# EAGLE design companion_revc (EAGLE 7.2.0)
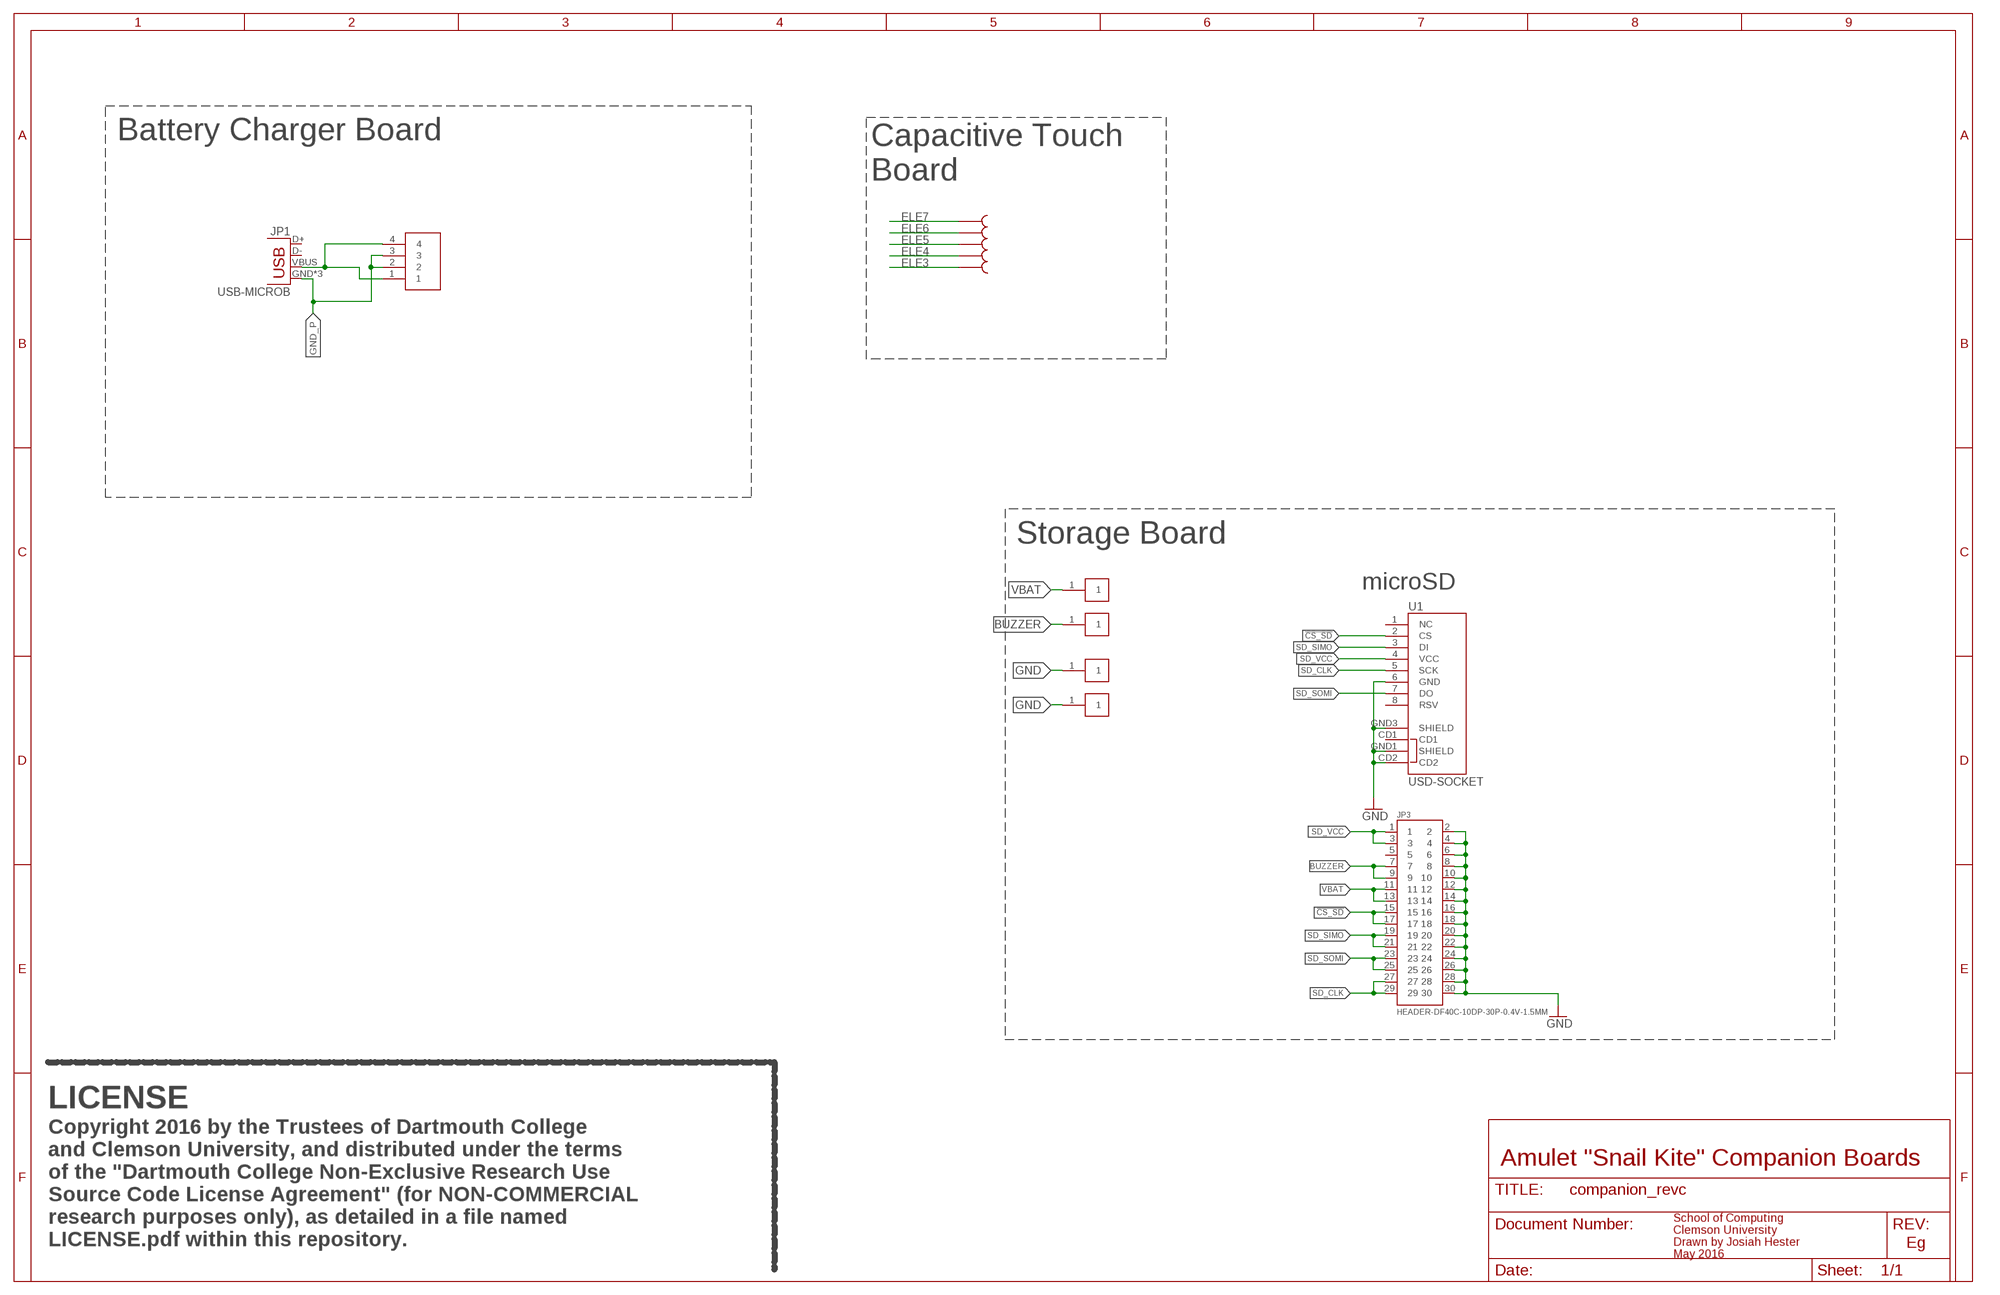
[diagram p0: schematic, sheet 1]

## Parts
JP1  USB-MICROB  [USB-MICROB]
JP3  HEADER-DF40C-10DP-30P-0.4V-1.5MM  [HEADER-DF40-30]
U1  USD-SOCKET  [MICROSD_1:1]
U$1  CTPAD  [CTPAD]
U$2  CTPAD  [CTPAD]
U$3  CTPAD  [CTPAD]
U$4  CTPAD  [CTPAD]
U$5  CTPAD  [CTPAD]
U$6  1PAD  [5X23MM_PAD]
U$7  1PAD  [5X23MM_PAD]
U$8  1PAD  [5X23MM_PAD]
U$9  1PAD  [5X23MM_PAD]
U$10  1.27MM-MILLMAX  [1X03-1.27MM]

## Nets
!CS_SD: JP3.15 JP3.17 U1.2(CS)
BUZZER: JP3.7 JP3.9 U$7.1
ELE3: U$5.P$1
ELE4: U$4.P$1
ELE5: U$3.P$1
ELE6: U$2.P$1
ELE7: U$1.P$1
GND: JP3.2 JP3.4 JP3.6 JP3.8 JP3.10 JP3.12 JP3.14 JP3.16 JP3.18 JP3.20 JP3.22 JP3.24 JP3.26 JP3.28 JP3.30 U1.6(GND) U1.CD2 U1.GND1(SHIELD) U1.GND3(SHIELD) U$8.1 U$9.1
GND_P: JP1.GND JP1.MT1(GND) JP1.MT2(GND) U$10.2 U$10.3
SD_CLK: JP3.27 JP3.29 U1.5(SCK)
SD_SIMO: JP3.19 JP3.21 U1.3(DI)
SD_SOMI: JP3.23 JP3.25 U1.7(DO)
SD_VCC: JP3.1 JP3.3 U1.4(VCC)
USB_VIN: JP1.VBUS U$10.1 U$10.4
VBAT: JP3.11 JP3.13 U$6.1
Unconnected: JP1.D+ JP1.D- JP3.5 U1.1(NC) U1.8(RSV) U1.CD1

## Notes on the sheet
- Battery Charger Board
- Capacitive Touch
  Board
- Storage Board
- microSD
- LICENSE
- Amulet "Snail Kite" Companion Boards
- Copyright 2016 by the Trustees of Dartmouth College 
  and Clemson University, and distributed under the terms
  of the "Dartmouth College Non-Exclusive Research Use 
  Source Code License Agreement" (for NON-COMMERCIAL
  research purposes only), as detailed in a file named 
  LICENSE.pdf within this repository.
- Eg
- School of Computing
  Clemson University
  Drawn by Josiah Hester
  May 2016

## Library data of the parts
JP1 = SparkFun-Connectors:USB: USB Connectors USB-B-PTH is fully proven SKU : PRT-00139/CONN-08278 USB-miniB is fully proven SKU : PRT-00587 USB-A-PCB is untested. USB-A-H is throughly reviewed, but untested. Spark Fun Electronics SKU : PRT-00437 USB-B-SMT is throughly reviewed, but untested. Needs silkscreen touching up. USB-A-S has not been used/tested USB-MB-H has not been used/tested USB-MICROB has been used. CONN-09505; PROD_ID: CONN-09505
JP3 = connectors:HEADER-DF40C-10DP-30P-0.4V-1.5MM: DF40 Series●0.4mm Pitch, 1.5 to 4.0mm Height, Board-to-Board and Board-to-FPC Connector 1.5mm Header (For use with shielded product) Digi-Key Part Number H11622CT-ND Quantity Available 3,874 Can ship immediately Manufacturer Hirose Electric Co Ltd </en/supplier-centers/h/hirose> Manufacturer Part Number DF40C-30DP-0.4V(51) Description 30 Position Connector Plug, Outer Shroud Contacts Surface Mount Gold Lead Free Status / RoHS Status Lead free / RoHS Compliant Moisture Sensitivity Level (MSL) 1 (Unlimited) Manufacturer Standard Lead Time 8 Weeks; DIGIKEY: H11622CT-ND
U1 = SparkFun-Connectors:USD-SOCKET: microSD Socket Push-push type uSD socket. Schematic element and footprint production proven. Spark Fun Electronics SKU : PRT-00127. tDoc lines correctly indicate media card edge positions when inserting (unlocked, locked, depressed). NOTE: CD1 and CD2 are connected internally; PROD_ID: CONN-07820
U$1-U$5 = captouch:CTPAD
U$6-U$9 = smd-pads:1PAD
U$10 = 1.27mm-headers:1.27MM-MILLMAX: Manafacturer: Mill-Max Manufacturing Corp. Manafacturer Part #: 851-13-004-40-001000 Description: 4 Position Receptacle Connector 0.050" (1.27mm) Surface Mount, Right Angle Gold

## Board
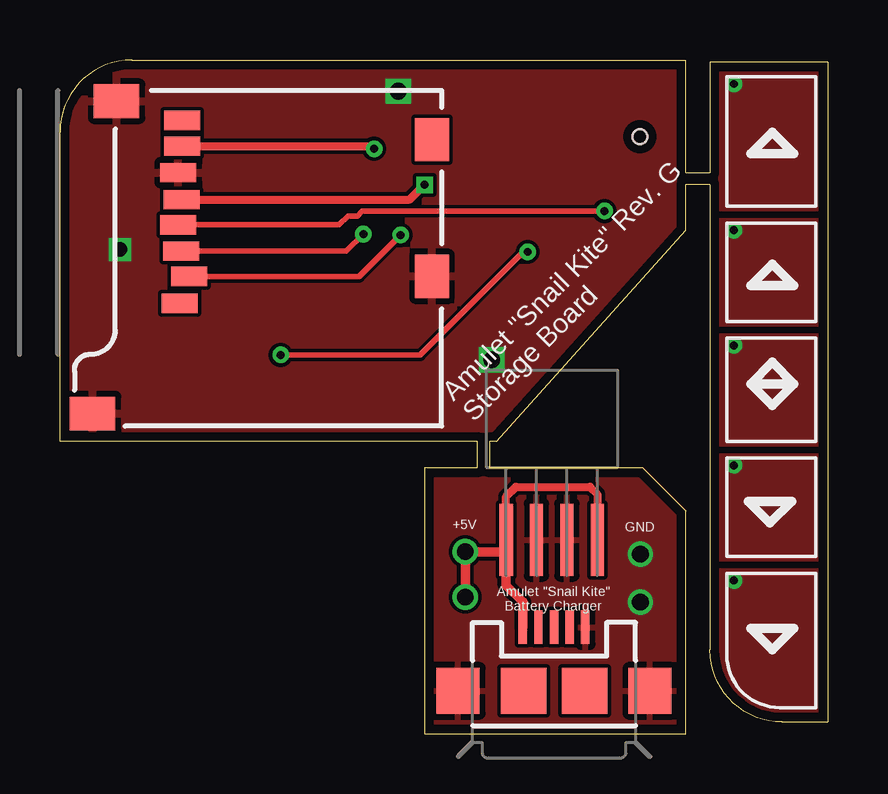
[diagram p1: board, top side]
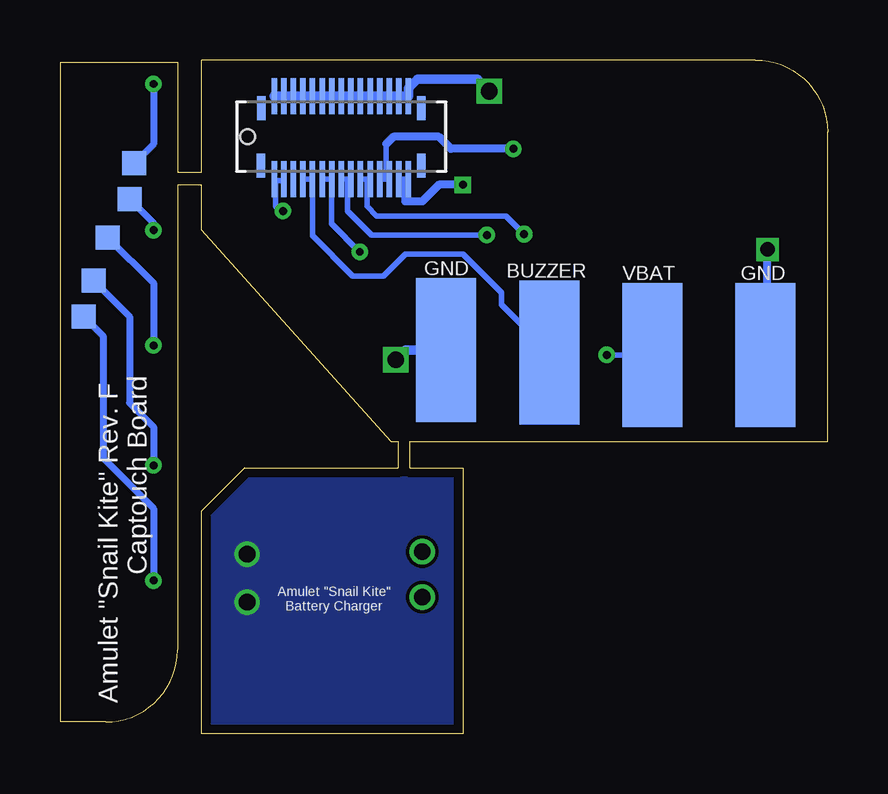
[diagram p2: board, bottom side, seen from below]

Size 32 x 28.1 mm. Coordinates in mm from the lower left corner, seen from the top.
Outline: 0,12.2 0,25.1 arc-90 3,28.1 26.1,28.1 26.1,23.4 27.1,23.4 27.1,28 32,28 32,0.5 30.1,0.5 arc-90 27.1,3.5 27.1,22.9 26.1,22.9 26.1,21 18.2,12.2 17.9,12.2 17.9,11.1 19.4,11.1 20.1,11.1 24.3,11.1 26.1,9.3 26.1,0 15.2,0 15.2,11.1 17.4,11.1 17.4,12.2 16.1,12.2 15.4,12.2 0,12.2
Copper layers (1+16): Top 0.0356mm / dielectric 1.5011mm / Bottom 0.0356mm
Design rules "LaenPCBOrder *": minimum track width 6mil, minimum drill 13mil, track to track 6mil, track to pad 6mil, pad to pad 6mil, via to via 6mil, smd to smd 6mil, copper to edge 15mil, drill to drill 6mil, minimum pad ring 7mil, minimum via ring 7mil, stop-mask expansion 3mil, vias tented up to drill 0mil, thermal gap 10mil

### Footprints (pad centres in the part's own frame; a part is rotated, then mirrored left to right if it is on the bottom)
USB-MICROB = smd 0.35 x 1.4: D+ 0,2.65; D- -0.65,2.65; GND 1.3,2.65; ID 0.65,2.65; VBUS -1.3,2.65 | smd 1.8 x 1.9: MT1 -4,0; MT2 4,0 | smd 1.9 x 1.9: P$1 -1.27,0; P$2 1.27,0
HEADER-DF40-30 = smd 0.23 x 1.5: 1 -2.8,-1.76; 2 -2.8,1.7; 3 -2.4,-1.76; 4 -2.4,1.7; 5 -2,-1.76; 6 -2,1.7; 7 -1.6,-1.76; 8 -1.6,1.7; 9 -1.2,-1.76; 10 -1.2,1.7; 11 -0.8,-1.76; 12 -0.8,1.7; 13 -0.4,-1.76; 14 -0.4,1.7; 15 0,-1.76; 16 0,1.7; 17 0.4,-1.76; 18 0.4,1.7; 19 0.8,-1.76; 20 0.8,1.7; 21 1.2,-1.76; 22 1.2,1.7; 23 1.6,-1.76; 24 1.6,1.7; 25 2,-1.76; 26 2,1.7; 27 2.4,-1.76; 28 2.4,1.7; 29 2.8,-1.76; 30 2.8,1.7 | smd 0.35 x 1: NC1 -3.35,-1.2; NC2 -3.335,1.2; NC3 3.335,1.2; NC4 3.335,-1.2 | hole 0.6: -3.905,0
MICROSD_1:1 = smd 0.8 x 1.5: 1 5.096,10.919; 2 6.218,10.519; 3 7.274,10.853; 4 8.367,10.982; 5 9.421,10.828; 6 10.539,10.973; 7 11.648,10.819; 8 12.721,10.819 | smd 1.8 x 1.4: CD1 11.92,0.4; CD2 6.22,0.4 | smd 1.4 x 1.9: GND1 0.497,14.55; GND3 13.52,13.55
CTPAD = smd 1 x 1: P$1 0,0
5X23MM_PAD = smd 2.5 x 6: 1 0,0
1X03-1.27MM = smd 3 x 0.56: 1 -1.5,-1.905; 2 -1.5,-0.635; 3 -1.5,0.635; 4 -1.5,1.905

### Placement (x,y rotation side)
JP1  20.6,1.8 0 top
JP3  20.27,24.9 0 bottom
U1  15.91,12.86 90 top
U$1  31,17.4 0 bottom
U$2  30.6,18.9 0 bottom
U$3  30,20.7 0 bottom
U$4  29.1,22.3 0 bottom
U$5  28.9,23.8 0 bottom
U$6  7.3,15.8 0 bottom
U$7  11.6,15.9 0 bottom
U$8  15.9,16 0 bottom
U$9  2.6,15.8 0 bottom
U$10  20.5,6.6 270 top

### Tracks (layer width: path | path; a pad name or v marks a point on that pad's centre or on a via)
!CS_SD  (via drill 0.33)
  Top 0.222: U1.2 12.48,19.08 v14.2,20.8
  Bottom 0.222: v14.2,20.8 19,20.8 20,21.8 20,23.01 JP3.17 JP3.15
BUZZER
  Bottom 0.222: U$7.1 13.6,17.9 13.6,18.4 15.2,20 17.6,20 18.5,19.1 19.8,19.1 21.47,20.77 JP3.9 JP3.7
ELE3  (via drill 0.33)
  Bottom 0.3: v28.1,27.1 28.1,24.6 U$5.P$1
  pour Top: 27.2,28 32.1,28 32.1,21.9 27.2,21.9
ELE4  (via drill 0.33)
  Bottom 0.3: U$4.P$1 28.1,21.3 v28.1,21
  pour Top: 27.2,21.4 32.1,21.4 32.1,17.1 27.2,17.1
ELE5  (via drill 0.33)
  Bottom 0.3: U$3.P$1 28.1,18.8 v28.1,16.2
  pour Top: 27.2,16.6 32.1,16.6 32.1,12.1 27.2,12.1
ELE6  (via drill 0.33)
  Bottom 0.3: U$2.P$1 29.1,17.4 29.1,13.8 28.1,12.8 v28.1,11.2
  pour Top: 27.2,11.6 32.1,11.6 32.1,7.3 27.2,7.3
ELE7  (via drill 0.33)
  Bottom 0.3: U$1.P$1 30.2,16.6 30.2,11.5 28.1,9.4 v28.1,6.4
  pour Top: 32.1,6.8 27.2,6.8 27.3,0.2 31.9,0.2 arc90 32.1,3.6
GND  (via drill 0.6, 0.7)
  Top 0.4: v14.1,26.8 14.1,26.7
  Bottom 0.33: U$9.1 2.5,15.9 v2.5,20.2
  Bottom 0.4: U$8.1 17.6,16 v18,15.6 | JP3.2 JP3.4 JP3.6 JP3.8 JP3.10 JP3.12 JP3.14 JP3.16 JP3.18 JP3.20 JP3.22 JP3.24 JP3.26 JP3.28 JP3.30 17.47,26.93 17.1,27.3 14.6,27.3 v14.1,26.8
  pour Top: -0.1,28.6 -0.1,12.4 0,12.3 18.2,12.3 26.2,20.3 26.2,28.2 0.3,28.2
GND_P  (via drill 0.7)
  other vias: 24.2,7.5 24.2,5.5
  pour Top: 15,11.1 15,0 26.1,0 26.1,11.1
  pour Bottom: 15,11.1 15,0 26.1,0 26.1,11.1
SD_CLK  (via drill 0.33)
  Top 0.333: U1.5 14.58,22.28 v15.2,22.9
  Bottom 0.222: JP3.27 JP3.29 17.6,23.01
  Bottom 0.333: v15.2,22.9 16.2,22.9 16.9,22.2 17.6,22.2 17.6,23.01
SD_SIMO  (via drill 0.33)
  Top 0.222: U1.3 11.93,20.13 v12.65,20.84
  Bottom 0.222: v12.65,20.84 13.4,21.6 18.8,21.6 19.2,22 19.2,23.01 JP3.21 JP3.19
SD_SOMI  (via drill 0.33)
  Top 0.34: U1.7 12.99,24.51 v13.1,24.4
  Bottom 0.222: 18.4,24.6 18.4,23.41 JP3.23 JP3.25
  Bottom 0.34: v13.1,24.4 15.7,24.4 16.2,24.9 18.1,24.9 18.4,24.6
SD_VCC  (via drill 0.33)
  Top 0.222: U1.4 11.63,21.23 12,21.6 12.4,21.6 12.6,21.8 v22.7,21.8
  Bottom 0.222: v22.7,21.8 22.8,21.8 23,22 23,23.07 | 23,23.07 JP3.1 | 23,23.07 22.74,23.07 JP3.3
USB_VIN  (via drill 0.7)
  Top 0.34: U$10.1 18.59,9.9 19,10.3 22.1,10.3 22.4,10 U$10.4
  Top 0.4: JP1.VBUS 19.3,5.5 18.6,6.2 18.6,7.5 | 18.6,7.5 U$10.1 | v16.9,5.7 v16.9,7.6 18.5,7.6 18.6,7.5
VBAT  (via drill 0.33)
  Top 0.222: v19.5,20.1 19.3,20.1 15,15.8 v9.2,15.8
  Bottom 0.222: v19.5,20.1 20.67,21.27 JP3.13 JP3.11 | v9.2,15.8 U$6.1

### Text on the board
tPlace: Amulet "Snail Kite" Rev. G / Storage Board | +5V | GND | Amulet "Snail Kite" / Battery Charger
bPlace: GND | VBAT | BUZZER | GND | Amulet "Snail Kite" Rev. F / Captouch Board | Amulet "Snail Kite" / Battery Charger